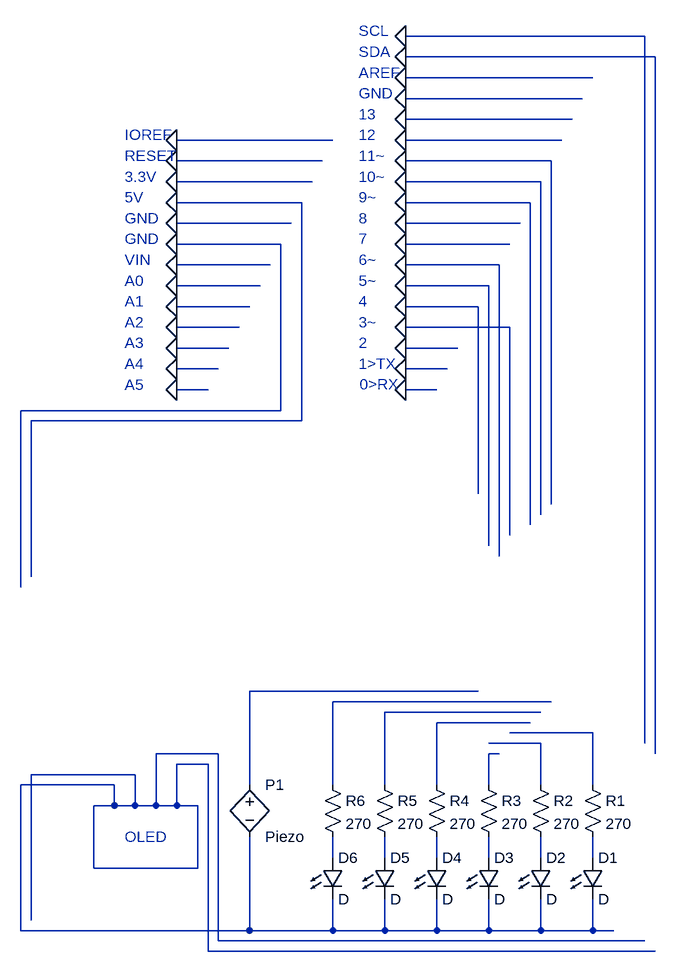
[diagram p0: schematic A4WSchematic.asc]
A4WSchematic.asc, the LTspice schematic file:
Version 4
SHEET 1 880 1268
WIRE 512 -144 144 -144
WIRE 528 -112 144 -112
WIRE 432 -80 144 -80
WIRE 416 -48 144 -48
WIRE 400 -16 144 -16
WIRE 32 16 -208 16
WIRE 384 16 144 16
WIRE 16 48 -208 48
WIRE 368 48 144 48
WIRE 0 80 -208 80
WIRE 352 80 144 80
WIRE -16 112 -208 112
WIRE 336 112 144 112
WIRE -32 144 -208 144
WIRE 320 144 144 144
WIRE -48 176 -208 176
WIRE 304 176 144 176
WIRE -64 208 -208 208
WIRE 288 208 144 208
WIRE -80 240 -208 240
WIRE 272 240 144 240
WIRE -96 272 -208 272
WIRE 256 272 144 272
WIRE -112 304 -208 304
WIRE 304 304 144 304
WIRE -128 336 -208 336
WIRE 224 336 144 336
WIRE -144 368 -208 368
WIRE 208 368 144 368
WIRE -160 400 -208 400
WIRE 192 400 144 400
WIRE -48 432 -48 176
WIRE -48 432 -448 432
WIRE -16 448 -16 112
WIRE -16 448 -432 448
WIRE 256 560 256 272
WIRE 368 576 368 48
WIRE 352 592 352 80
WIRE 336 608 336 112
WIRE 304 624 304 304
WIRE 272 640 272 240
WIRE 288 656 288 208
WIRE -432 688 -432 448
WIRE -448 704 -448 432
WIRE 256 864 -96 864
WIRE 368 880 32 880
WIRE 352 896 112 896
WIRE 336 912 192 912
WIRE 432 928 304 928
WIRE 352 944 272 944
WIRE 512 944 512 -144
WIRE -144 960 -240 960
WIRE 288 960 272 960
WIRE 528 960 528 -112
WIRE -160 976 -208 976
WIRE -272 992 -432 992
WIRE -304 1008 -448 1008
WIRE -96 1008 -96 864
WIRE 32 1008 32 880
WIRE 112 1008 112 896
WIRE 192 1008 192 912
WIRE 272 1008 272 960
WIRE 352 1008 352 944
WIRE 432 1008 432 928
WIRE -304 1040 -304 1008
WIRE -304 1040 -336 1040
WIRE -272 1040 -272 992
WIRE -272 1040 -304 1040
WIRE -240 1040 -240 960
WIRE -240 1040 -272 1040
WIRE -208 1040 -208 976
WIRE -208 1040 -240 1040
WIRE -176 1040 -208 1040
WIRE 32 1120 32 1088
WIRE 112 1120 112 1088
WIRE 192 1120 192 1088
WIRE 272 1120 272 1088
WIRE 352 1120 352 1088
WIRE 432 1120 432 1088
WIRE -336 1136 -336 1040
WIRE -176 1136 -176 1040
WIRE -176 1136 -336 1136
WIRE -432 1216 -432 992
WIRE -448 1232 -448 1008
WIRE -96 1232 -96 1088
WIRE -96 1232 -448 1232
WIRE 32 1232 32 1184
WIRE 32 1232 -96 1232
WIRE 112 1232 112 1184
WIRE 112 1232 32 1232
WIRE 192 1232 192 1184
WIRE 192 1232 112 1232
WIRE 272 1232 272 1184
WIRE 272 1232 192 1232
WIRE 352 1232 352 1184
WIRE 352 1232 272 1232
WIRE 432 1232 432 1184
WIRE 432 1232 352 1232
WIRE 464 1232 432 1232
WIRE -144 1248 -144 960
WIRE 512 1248 -144 1248
WIRE -160 1264 -160 976
WIRE 528 1264 -160 1264
FLAG 144 -144 0
FLAG 144 -112 0
FLAG 144 -80 0
FLAG 144 -48 0
FLAG 144 -16 0
FLAG 144 16 0
FLAG 144 48 0
FLAG 144 80 0
FLAG 144 112 0
FLAG 144 144 0
FLAG 144 176 0
FLAG 144 208 0
FLAG 144 240 0
FLAG 144 272 0
FLAG 144 304 0
FLAG 144 336 0
FLAG 144 368 0
FLAG 144 400 0
FLAG -208 16 0
FLAG -208 48 0
FLAG -208 80 0
FLAG -208 112 0
FLAG -208 144 0
FLAG -208 176 0
FLAG -208 208 0
FLAG -208 240 0
FLAG -208 272 0
FLAG -208 304 0
FLAG -208 336 0
FLAG -208 368 0
FLAG -208 400 0
SYMBOL LED 416 1120 R0
SYMATTR InstName D1
SYMBOL LED 336 1120 R0
SYMATTR InstName D2
SYMBOL LED 256 1120 R0
SYMATTR InstName D3
SYMBOL LED 176 1120 R0
SYMATTR InstName D4
SYMBOL LED 96 1120 R0
SYMATTR InstName D5
SYMBOL LED 16 1120 R0
SYMATTR InstName D6
SYMBOL res 416 992 R0
SYMATTR InstName R1
SYMATTR Value 270
SYMATTR SpiceLine tol=1
SYMBOL res 336 992 R0
SYMATTR InstName R2
SYMATTR Value 270
SYMATTR SpiceLine tol=1
SYMBOL res 256 992 R0
SYMATTR InstName R3
SYMATTR Value 270
SYMATTR SpiceLine tol=1
SYMBOL res 176 992 R0
SYMATTR InstName R4
SYMATTR Value 270
SYMATTR SpiceLine tol=1
SYMBOL res 96 992 R0
SYMATTR InstName R5
SYMATTR Value 270
SYMATTR SpiceLine tol=1
SYMBOL res 16 992 R0
SYMATTR InstName R6
SYMATTR Value 270
SYMATTR SpiceLine tol=1
SYMBOL bv -96 992 R0
SYMATTR InstName P1
SYMATTR Value Piezo
TEXT 104 376 Top 2 ;0>RX
TEXT 72 360 Left 2 ;1>TX
TEXT 72 328 Left 2 ;2
TEXT 72 296 Left 2 ;3~
TEXT 72 264 Left 2 ;4
TEXT 72 232 Left 2 ;5~
TEXT 72 200 Left 2 ;6~
TEXT 72 168 Left 2 ;7
TEXT 72 136 Left 2 ;8
TEXT 72 104 Left 2 ;9~
TEXT 72 72 Left 2 ;10~
TEXT 72 40 Left 2 ;11~
TEXT 72 8 Left 2 ;12
TEXT 72 -24 Left 2 ;13
TEXT 72 -56 Left 2 ;GND
TEXT 72 -88 Left 2 ;AREF
TEXT 72 -120 Left 2 ;SDA
TEXT 72 -152 Left 2 ;SCL
TEXT -288 392 Left 2 ;A5
TEXT -288 360 Left 2 ;A4
TEXT -288 328 Left 2 ;A3
TEXT -288 296 Left 2 ;A2
TEXT -288 264 Left 2 ;A1
TEXT -288 232 Left 2 ;A0
TEXT -288 200 Left 2 ;VIN
TEXT -288 168 Left 2 ;GND
TEXT -288 136 Left 2 ;GND
TEXT -288 104 Left 2 ;5V
TEXT -288 72 Left 2 ;3.3V
TEXT -288 40 Left 2 ;RESET
TEXT -288 8 Left 2 ;IOREF
TEXT -288 1088 Left 2 ;OLED

The netlist it stands for:
* A4WSchematic.asc
D1 N014 N007 D
D2 N013 N007 D
D3 N012 N007 D
D4 N011 N007 D
D5 N010 N007 D
D6 N009 N007 D
R1 N005 N014 270 tol=1
R2 N006 N013 270 tol=1
R3 N008 N012 270 tol=1
R4 N004 N011 270 tol=1
R5 N003 N010 270 tol=1
R6 N002 N009 270 tol=1
B§P1 N001 N007 Piezo
.model D D
.lib standard.dio
* 0>RX
* 1>TX
* 2
* 3~
* 4
* 5~
* 6~
* 7
* 8
* 9~
* 10~
* 11~
* 12
* 13
* GND
* AREF
* SDA
* SCL
* A5
* A4
* A3
* A2
* A1
* A0
* VIN
* GND
* GND
* 5V
* 3.3V
* RESET
* IOREF
* OLED
.backanno
.end